# EAGLE board eps_version_0.4.0 (EAGLE 9.6.2), part 1 of 2
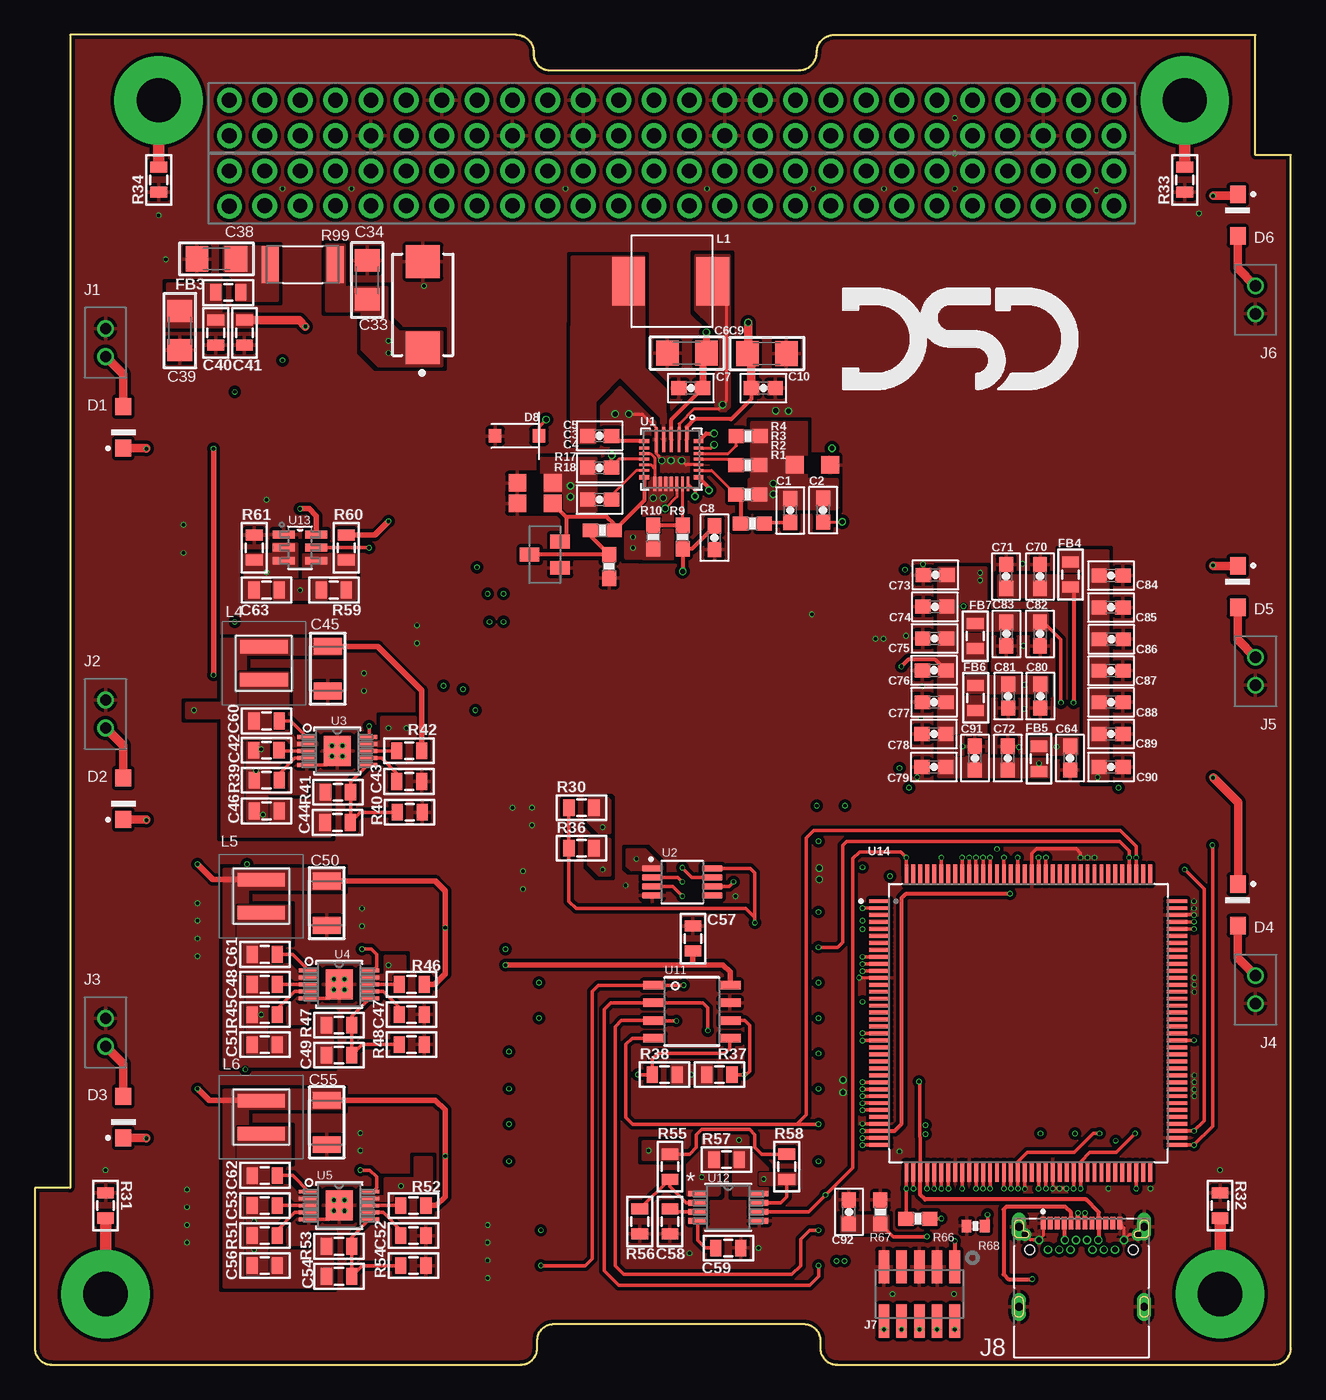
[diagram p9: board, top side]
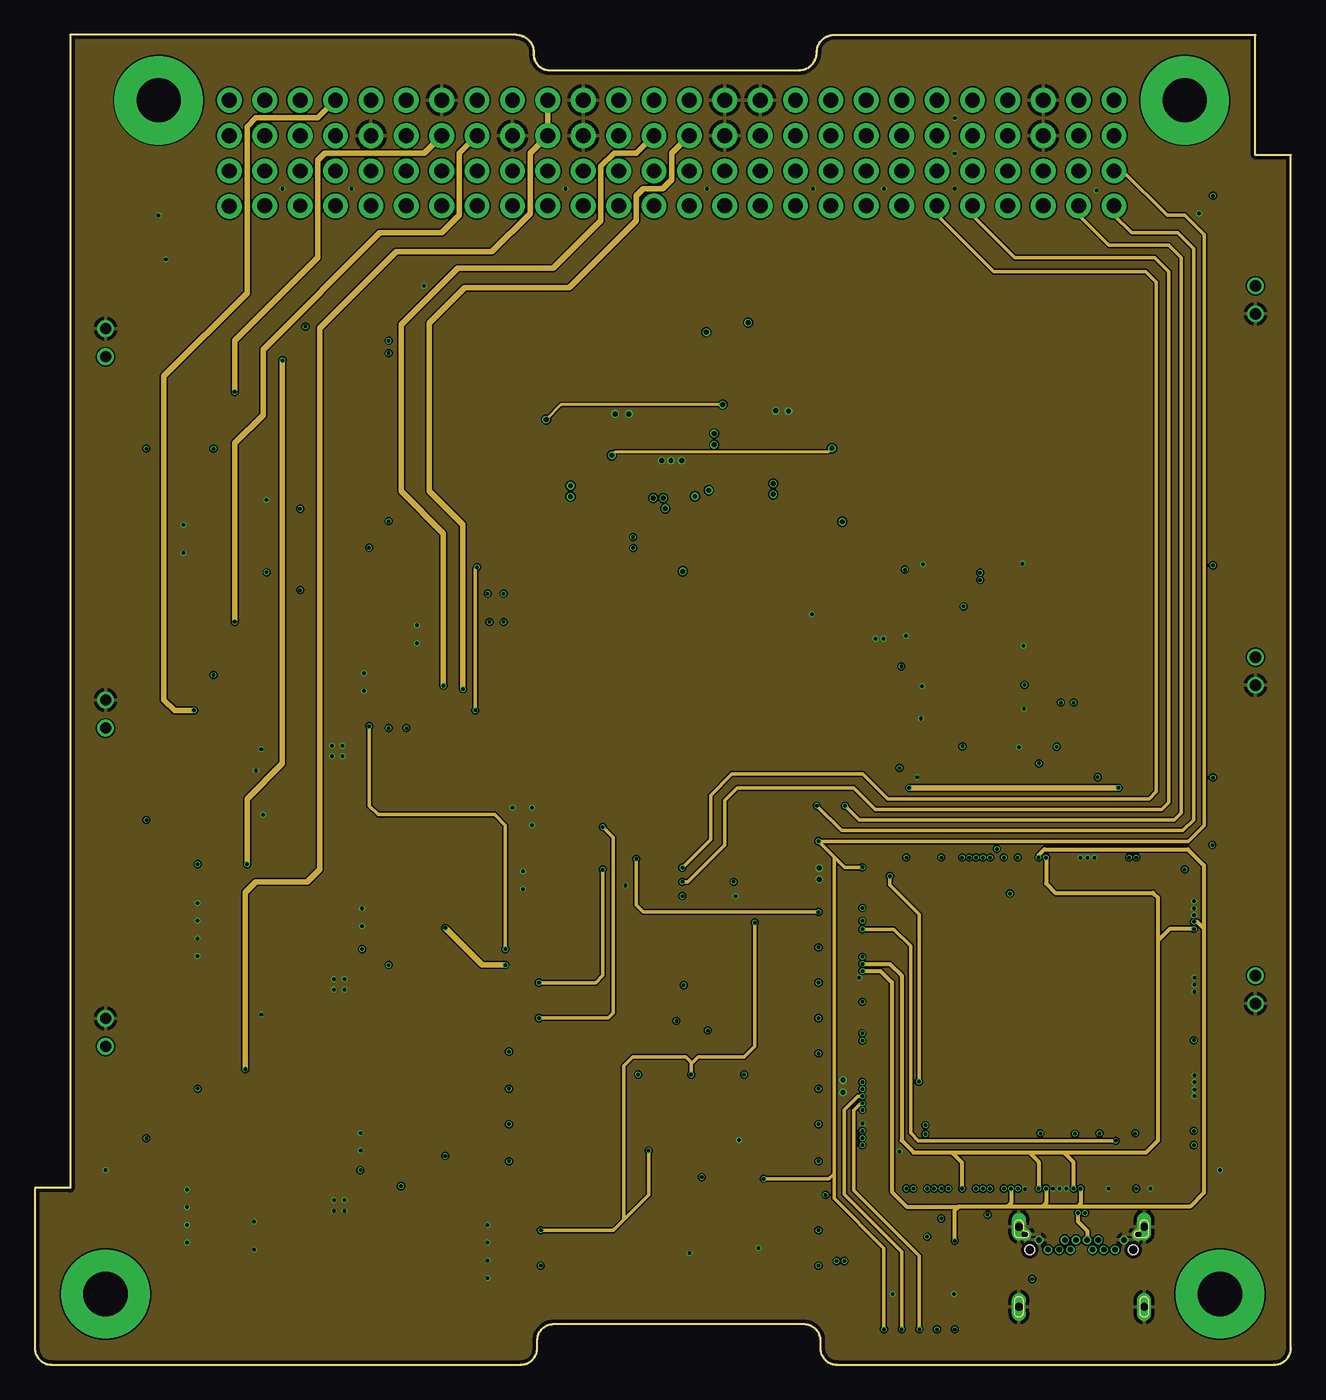
[diagram p10: board, inner layer Route2]
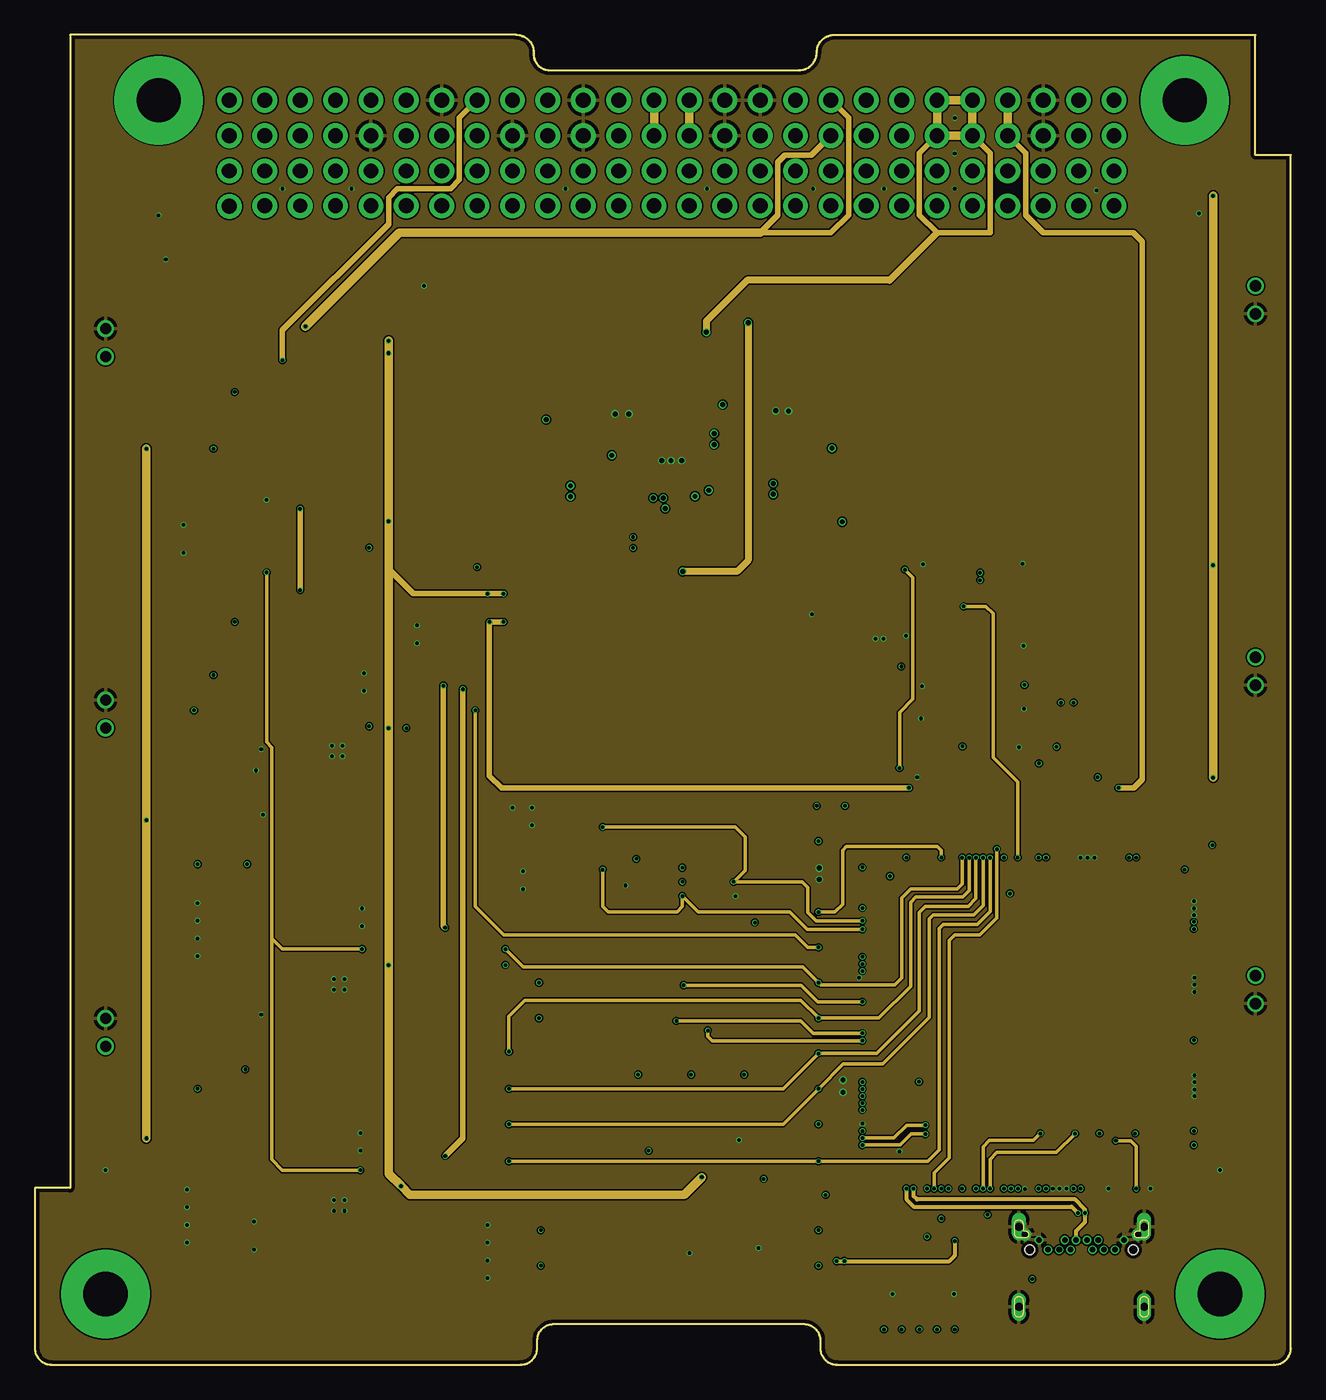
[diagram p11: board, inner layer Route15]
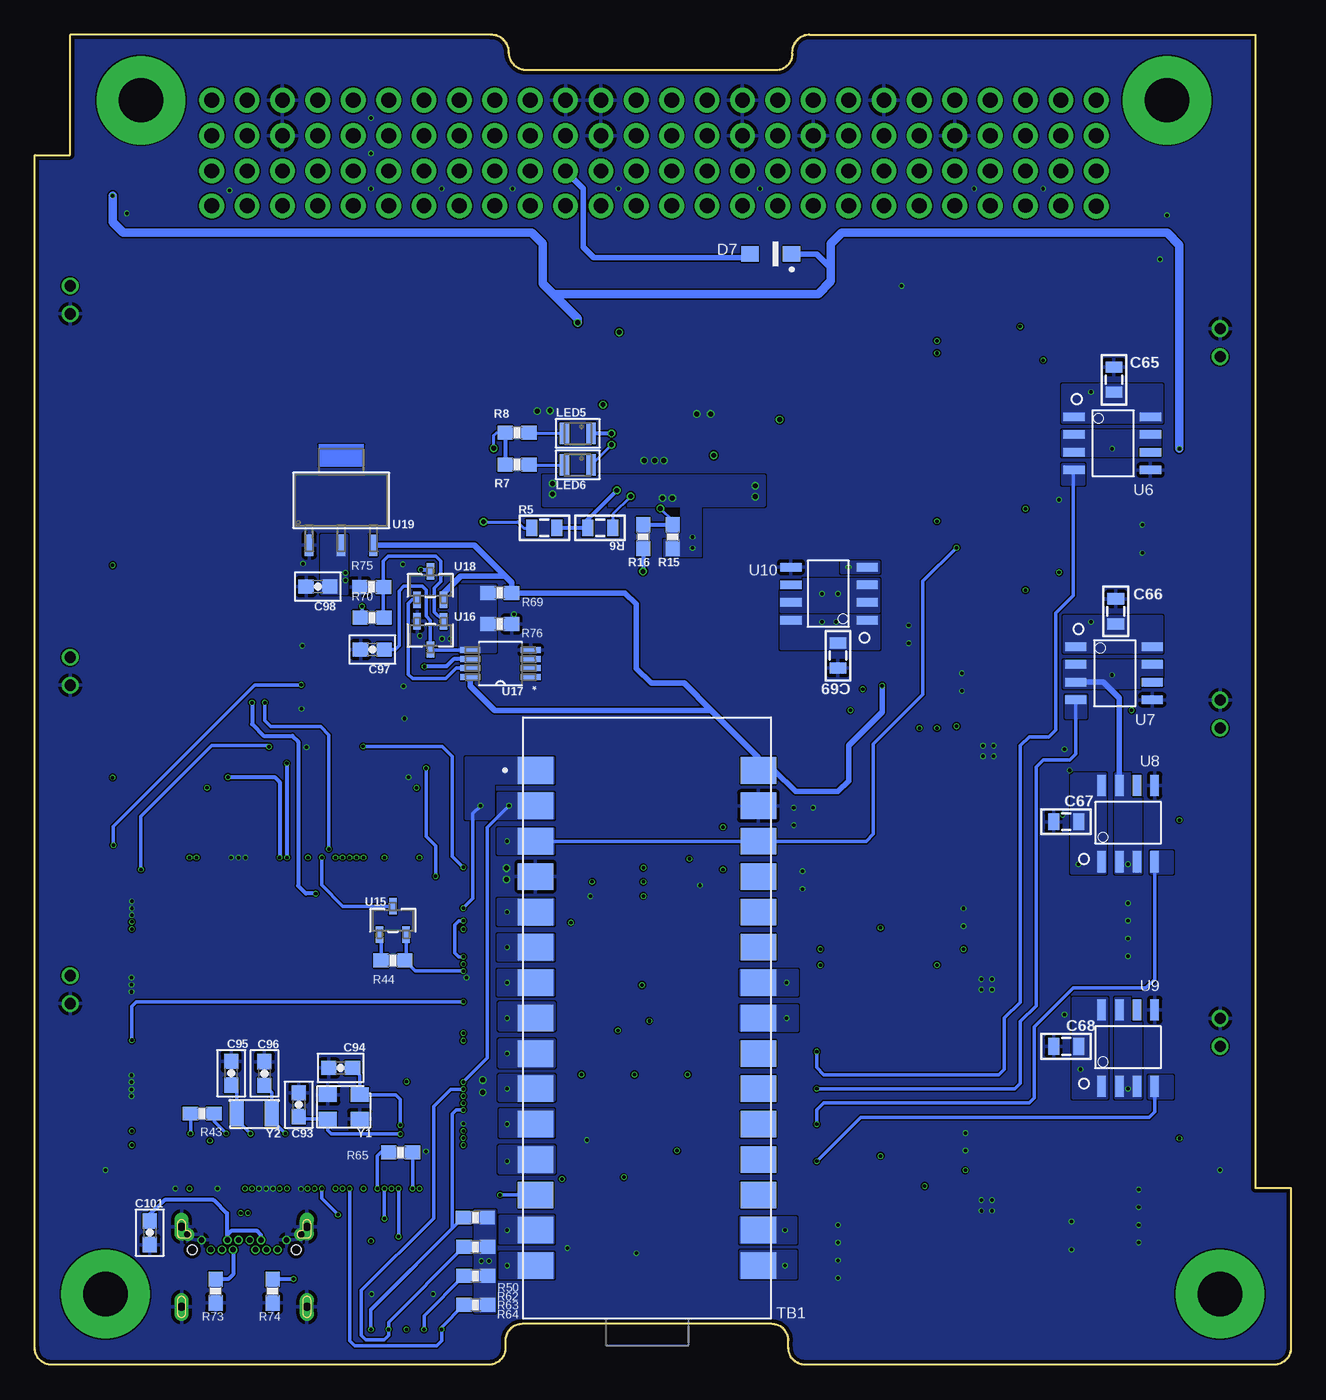
[diagram p12: board, bottom side, seen from below]

Size 90.17 x 95.5 mm. Coordinates in mm from the lower left corner, seen from the top.
Copper layers (1+2*15+16): Top 0.035mm / dielectric 1.5mm / Route2 0.035mm / dielectric 0.15mm / Route15 0.035mm / dielectric 0.2mm / Bottom 0.035mm
Design rules "AdvancedCircuitsExpensiveRestrictions *": minimum track width 4mil, minimum drill 4mil, track to track 4mil, track to pad 4mil, pad to pad 4mil, via to via 4mil, smd to smd 4mil, copper to edge 10mil, drill to drill 4mil, minimum pad ring 1mil, minimum via ring 1mil, stop-mask expansion 4mil, vias tented up to drill 0mil, thermal gap 10mil

## Footprints (pad centres in the part's own frame; a part is rotated, then mirrored left to right if it is on the bottom)
0603-CAP = smd 1.1 x 1: 1 -0.85,0; 2 0.85,0
1206 = smd 1.6 x 1.8: 1 -1.4,0; 2 1.4,0
CAPMP7343X430N = smd 2.35 x 2.45: 1 -3.1,0; 2 3.1,0
0805 = smd 0.8 x 1.2: 1 -0.9,0; 2 0.9,0
1210 = smd 1.2 x 2: 1 -1.6,0; 2 1.6,0
SODFL3616X98N = smd 1.24 x 1.12: A 1.49,0; C -1.49,0
SOD123 = smd 0.9 x 0.95: 1 0,0; 2 3.15,0
PC104_WCONN = drill 1.067 pad 1.778: 1.1 13.97,83.185; 1.2 13.97,85.725; 1.3 16.51,83.223; 1.4 16.51,85.725; 1.6 19.05,85.725; 1.7 21.59,83.223; 1.8 21.59,85.725; 1.9 24.13,83.223; 1.10 24.13,85.725; 1.11 26.67,83.223; 1.12 26.67,85.725; 1.13 29.21,83.223; 1.14 29.21,85.725; 1.15 31.75,83.223; 1.16 31.75,85.725; 1.17 34.29,83.223; 1.18 34.29,85.725; 1.19 36.83,83.223; 1.20 36.83,85.725; 1.21 39.37,83.223; 1.22 39.37,85.725; 1.23 41.91,83.223; 1.24 41.91,85.725; 1.25 44.45,83.223; 1.26 44.45,85.725; 1.27 46.99,83.223; 1.28 46.99,85.725; 1.29 49.53,83.223; 1.30 49.53,85.725; 1.31 52.07,83.223; 1.32 52.07,85.725; 1.33 54.61,83.223; 1.34 54.61,85.725; 1.35 57.15,83.223; 1.36 57.15,85.725; 1.37 59.69,83.223; 1.38 59.69,85.725; 1.39 62.23,83.223; 1.40 62.23,85.725; 1.41 64.77,83.223; 1.42 64.77,85.725; 1.43 67.31,83.223; 1.44 67.31,85.725; 1.45 69.85,83.223; 1.46 69.85,85.725; 1.47 72.39,83.223; 1.48 72.39,85.725; 1.49 74.93,83.223; 1.50 74.93,85.725; 1.51 77.47,83.223; 1.52 77.47,85.725; 2.1 13.97,88.265; 2.2 13.97,90.805; 2.3 16.51,88.265; 2.4 16.51,90.805; 2.5 19.05,88.265; 2.6 19.05,90.805; 2.7 21.59,88.265; 2.8 21.59,90.805; 2.9 24.13,88.265; 2.10 24.13,90.805; 2.11 26.67,88.265; 2.12 26.67,90.805; 2.13 29.21,88.265; 2.14 29.21,90.805; 2.15 31.75,88.265; 2.16 31.75,90.805; 2.17 34.29,88.265; 2.18 34.29,90.805; 2.19 36.83,88.265; 2.20 36.83,90.805; 2.21 39.37,88.265; 2.22 39.37,90.805; 2.23 41.91,88.265; 2.24 41.91,90.805; 2.25 44.45,88.265; 2.26 44.45,90.805; 2.27 46.99,88.265; 2.28 46.99,90.805; 2.29 49.53,88.265; 2.30 49.53,90.805; 2.31 52.07,88.265; 2.32 52.07,90.805; 2.33 54.61,88.265; 2.34 54.61,90.805; 2.35 57.15,88.265; 2.36 57.15,90.805; 2.37 59.69,88.265; 2.38 59.69,90.805; 2.39 62.23,88.265; 2.40 62.23,90.805; 2.41 64.77,88.265; 2.42 64.77,90.805; 2.43 67.31,88.265; 2.44 67.31,90.805; 2.45 69.85,88.265; 2.46 69.85,90.805; 2.47 72.39,88.265; 2.48 72.39,90.805; 2.49 74.93,88.265; 2.50 74.93,90.805; 2.51 77.47,88.265; 2.52 77.47,90.805 | drill 1.016 pad 1.778: 1.5 19.05,83.223 | drill 3.175 pad 6.35: P1 5.08,5.08; P2 85.09,5.08; P3 82.55,90.805; P4 8.89,90.805
2MM_2PIN_HEADER = drill 0.8: 1 0,0; 2 2.007,0
2X5_127 = smd 2.388 x 0.762: 1 -1.95,2.54; 2 1.95,2.54; 3 -1.95,1.27; 4 1.95,1.27; 5 -1.95,0; 6 1.95,0; 7 -1.95,-1.27; 8 1.95,-1.27; 9 -1.95,-2.54; 10 1.95,-2.54
CUI_UJ31-CH-G1-SMT-TR = smd 0.35 x 0.89: A1 0,0; A2 0.5,0; A3 1,0; A4 1.5,0; A5 2,0; A6 2.5,0; A7 3,0; A8 3.5,0; A9 4,0; A10 4.5,0; A11 5,0; A12 5.5,0 | drill 0.4 pad 0.6: B1 5.8,-1.205; B2 5.15,-1.905; B3 4.35,-1.905; B4 3.95,-1.205; B5 3.55,-1.905; B6 3.15,-1.205; B7 2.35,-1.205; B8 1.95,-1.905; B9 1.55,-1.205; B10 1.15,-1.905; B11 0.35,-1.905; B12 -0.3,-1.205 | drill 0.6 pad 1 long: SH1 -1.75,-6.005; SH3 -1.75,-0.255; SH4 7.25,-6.005; SH6 7.25,-0.255 | drill 0.5 pad 0.9: SH2 -1.3,-0.805; SH5 6.8,-0.805 | hole 0.7: -0.975,-1.905; 6.475,-1.905
FXL0630 = smd 2.35 x 3.5: 1 0,0; 2 6.05,0
XFL4030472MEB = smd 0.98 x 3.4: 1 -1.185,0; 2 1.185,0
LED_0805 = smd 0.711 x 1.524: 1 0,0; 2 1.905,0
SOT23 = smd 1 x 1.4: 1 0,0; 2 1.9,0; 3 0.95,2.2
GND-GNDA-1,27MM = smd 1.27 x 1.27: GND -1.27,0; GNDA 1.27,0
0603-RES = smd 1.1 x 1: 1 -0.85,0; 2 0.85,0
0402-RES = smd 0.7 x 0.9: 1 -0.65,0; 2 0.65,0
RESC5025X70N = smd 1.2 x 2.67: 1 -2.335,0; 2 2.335,0
SHIELD_ARDUINO_NANO = smd 2.54 x 1.905: P1 -8.001,17.78; P2 -8.001,15.24; P3 -8.001,12.7; P4 -8.001,10.16; P5 -8.001,7.62; P6 -8.001,5.08; P7 -8.001,2.54; P8 -8.001,0; P9 -8.001,-2.54; P10 -8.001,-5.08; P11 -8.001,-7.62; P12 -8.001,-10.16; P13 -8.001,-12.7; P14 -8.001,-15.24; P15 -8.001,-17.78; P16 8.001,-17.78; P17 8.001,-15.24; P18 8.001,-12.7; P19 8.001,-10.16; P20 8.001,-7.62; P21 8.001,-5.08; P22 8.001,-2.54; P23 8.001,0; P24 8.001,2.54; P25 8.001,5.08; P26 8.001,7.62; P27 8.001,10.16; P28 8.001,12.7; P29 8.001,15.24; P30 8.001,17.78
IC26_MP2639A_MNP = smd 1.803 x 0.203: 1 -1.4,1.1; 2 -1.4,0.55; 3 -1.4,0; 4 -1.4,-0.55; 5 -1.4,-1.1 | smd 0.305 x 0.711: 6 -1.3,-1.95; 12 1.3,-1.95; 20 1.3,1.95; 26 -1.3,1.95 | smd 0.203 x 0.711: 7 -0.8,-1.95; 8 -0.4,-1.95; 9 0,-1.95; 10 0.4,-1.95; 11 0.8,-1.95; 21 0.8,1.95; 22 0.4,1.95; 23 0,1.95; 24 -0.4,1.95; 25 -0.8,1.95 | smd 1.041 x 0.203: 13 1.775,-1.2; 14 1.775,-0.8; 15 1.775,-0.4; 16 1.775,0; 17 1.775,0.4; 18 1.775,0.8; 19 1.775,1.2
SOP65P490X110-8N = smd 1.47 x 0.48: 1 -2.15,0.975; 2 -2.15,0.325; 3 -2.15,-0.325; 4 -2.15,-0.975; 5 2.15,-0.975; 6 2.15,-0.325; 7 2.15,0.325; 8 2.15,0.975
MSOP-10_MSE = smd 1.397 x 0.279: 1 -2.184,1.001; 2 -2.184,0.5; 3 -2.184,0; 4 -2.184,-0.5; 5 -2.184,-1.001; 6 2.184,-1.001; 7 2.184,-0.5; 8 2.184,0; 9 2.184,0.5; 10 2.184,1.001 | smd 1.93 x 2.159: 11 0,0
SO8 = smd 1.524 x 0.61: 1 -2.743,1.27; 2 -2.743,0; 3 -2.743,-1.27; 4 -2.743,-2.54; 5 2.743,-2.54; 6 2.743,-1.27; 7 2.743,0; 8 2.743,1.27
SOIC-8 = smd 1.524 x 0.61: 1 -2.68,1.855; 2 -2.68,0.585; 3 -2.68,-0.685; 4 -2.68,-1.955; 5 2.78,-1.955; 6 2.78,-0.685; 7 2.78,0.585; 8 2.78,1.855
21-0036K_MXM = smd 1.321 x 0.406: 1 -2.21,0.975; 2 -2.21,0.325; 3 -2.21,-0.325; 4 -2.21,-0.975; 5 2.21,-0.975; 6 2.21,-0.325; 7 2.21,0.325; 8 2.21,0.975
DDC0006A_N = smd 1.575 x 0.559: 1 -1.168,0.95; 2 -1.168,0; 3 -1.168,-0.95; 4 1.168,-0.95; 5 1.168,0; 6 1.168,0.95
LQFP144 = smd 1.47 x 0.28: 1 -10.67,8.75; 2 -10.67,8.25; 3 -10.67,7.75; 4 -10.67,7.25; 5 -10.67,6.75; 6 -10.67,6.25; 7 -10.67,5.75; 8 -10.67,5.25; 9 -10.67,4.75; 10 -10.67,4.25; 11 -10.67,3.75; 12 -10.67,3.25; 13 -10.67,2.75; 14 -10.67,2.25; 15 -10.67,1.75; 16 -10.67,1.25; 17 -10.67,0.75; 18 -10.67,0.25; 19 -10.67,-0.25; 20 -10.67,-0.75; 21 -10.67,-1.25; 22 -10.67,-1.75; 23 -10.67,-2.25; 24 -10.67,-2.75; 25 -10.67,-3.25; 26 -10.67,-3.75; 27 -10.67,-4.25; 28 -10.67,-4.75; 29 -10.67,-5.25; 30 -10.67,-5.75; 31 -10.67,-6.25; 32 -10.67,-6.75; 33 -10.67,-7.25; 34 -10.67,-7.75; 35 -10.67,-8.25; 36 -10.67,-8.75; 73 10.67,-8.75; 74 10.67,-8.25; 75 10.67,-7.75; 76 10.67,-7.25; 77 10.67,-6.75; 78 10.67,-6.25; 79 10.67,-5.75; 80 10.67,-5.25; 81 10.67,-4.75; 82 10.67,-4.25; 83 10.67,-3.75; 84 10.67,-3.25; 85 10.67,-2.75; 86 10.67,-2.25; 87 10.67,-1.75; 88 10.67,-1.25; 89 10.67,-0.75; 90 10.67,-0.25; 91 10.67,0.25; 92 10.67,0.75; 93 10.67,1.25; 94 10.67,1.75; 95 10.67,2.25; 96 10.67,2.75; 97 10.67,3.25; 98 10.67,3.75; 99 10.67,4.25; 100 10.67,4.75; 101 10.67,5.25; 102 10.67,5.75; 103 10.67,6.25; 104 10.67,6.75; 105 10.67,7.25; 106 10.67,7.75; 107 10.67,8.25; 108 10.67,8.75 | smd 0.28 x 1.47: 37 -8.75,-10.67; 38 -8.25,-10.67; 39 -7.75,-10.67; 40 -7.25,-10.67; 41 -6.75,-10.67; 42 -6.25,-10.67; 43 -5.75,-10.67; 44 -5.25,-10.67; 45 -4.75,-10.67; 46 -4.25,-10.67; 47 -3.75,-10.67; 48 -3.25,-10.67; 49 -2.75,-10.67; 50 -2.25,-10.67; 51 -1.75,-10.67; 52 -1.25,-10.67; 53 -0.75,-10.67; 54 -0.25,-10.67; 55 0.25,-10.67; 56 0.75,-10.67; 57 1.25,-10.67; 58 1.75,-10.67; 59 2.25,-10.67; 60 2.75,-10.67; 61 3.25,-10.67; 62 3.75,-10.67; 63 4.25,-10.67; 64 4.75,-10.67; 65 5.25,-10.67; 66 5.75,-10.67; 67 6.25,-10.67; 68 6.75,-10.67; 69 7.25,-10.67; 70 7.75,-10.67; 71 8.25,-10.67; 72 8.75,-10.67; 109 8.75,10.67; 110 8.25,10.67; 111 7.75,10.67; 112 7.25,10.67; 113 6.75,10.67; 114 6.25,10.67; 115 5.75,10.67; 116 5.25,10.67; 117 4.75,10.67; 118 4.25,10.67; 119 3.75,10.67; 120 3.25,10.67; 121 2.75,10.67; 122 2.25,10.67; 123 1.75,10.67; 124 1.25,10.67; 125 0.75,10.67; 126 0.25,10.67; 127 -0.25,10.67; 128 -0.75,10.67; 129 -1.25,10.67; 130 -1.75,10.67; 131 -2.25,10.67; 132 -2.75,10.67; 133 -3.25,10.67; 134 -3.75,10.67; 135 -4.25,10.67; 136 -4.75,10.67; 137 -5.25,10.67; 138 -5.75,10.67; 139 -6.25,10.67; 140 -6.75,10.67; 141 -7.25,10.67; 142 -7.75,10.67; 143 -8.25,10.67; 144 -8.75,10.67
TO-236_SOT23_NEX = smd 0.533 x 1.168: 1 -0.95,-1.016; 2 0.95,-1.016; 3 0,1.016
DGK8 = smd 1.422 x 0.432: 1 -2.172,0.975; 2 -2.172,0.325; 3 -2.172,-0.325; 4 -2.172,-0.975; 5 2.172,-0.975; 6 2.172,-0.325; 7 2.172,0.325; 8 2.172,0.975
SOT223-3_ONS = smd 0.61 x 1.549: 1 -2.299,-3.226; 2 0,-3.226; 3 2.299,-3.226
ABM8 = smd 1.3 x 1.05: 1 0.65,0.525; 2 2.95,0.525; 3 2.95,2.275; 4 0.65,2.275
FC-135 = smd 1 x 1.8: 1 0.5,0.9; 2 3,0.9

## Placement (x,y rotation side)
C1  33pF  [0603-CAP]  54.23,61.34 270 top
C2  0  [0603-CAP]  56.59,61.37 270 top
C3  1uF  [0603-CAP]  40.54,64.41 180 top
C4  0.1uF  [0603-CAP]  40.54,62.13 180 top
C5  0.1uF  [0603-CAP]  40.54,66.7 0 top
C6  10uF  [1206]  46.81,72.64 180 top
C7  1uF  [0603-CAP]  47.09,70.13 180 top
C8  4.7uF  [0603-CAP]  48.79,59.39 90 top
C9  10uF  [1206]  52.55,72.62 180 top
C10  4.7uF  [0603-CAP]  52.3,70.13 180 top
C33  22uF  [CAPMP7343X430N]  27.86,76.12 90 top
C34  4.7uF  [1206]  23.86,77.9 90 top
C38  4.7uF  [1206]  13.04,79.41 180 top
C39  4.7uF  [1206]  10.41,74.26 270 top
C40  0.1uF  [0805]  12.99,74.11 270 top
C41  1uF  [0805]  15.05,74.11 270 top
C42  1uF  [0805]  16.63,44.12 180 top
C43  0.1uF  [0805]  26.88,41.88 0 top
C44  10pF  [0805]  21.73,38.94 180 top
C45  47uF  [1210]  21.03,49.98 270 top
C46  4.7uF  [0805]  16.64,39.77 180 top
C47  0.1uF  [0805]  27.05,25.15 0 top
C48  1uF  [0805]  16.51,27.3 180 top
C49  10pF  [0805]  21.84,22.23 180 top
C50  47uF  [1210]  20.95,33.15 270 top
C51  4.7uF  [0805]  16.51,22.99 180 top
C52  0.1uF  [0805]  27.18,9.27 0 top
C53  1uF  [0805]  16.51,11.43 180 top
C54  10pF  [0805]  21.84,6.35 180 top
C55  47uF  [1210]  20.95,17.4 270 top
C56  4.7uF  [0805]  16.51,7.11 180 top
C57  0.1uF  [0805]  47.24,30.61 90 top
C58  0.1uF  [0805]  45.59,10.29 270 top
C59  1uF  [0805]  49.78,8.38 0 top
C60  C61  [0805]  16.64,46.23 180 top
C61  0.1uF  [0805]  16.51,29.46 180 top
C62  0.1uF  [0805]  16.51,13.59 180 top
C63  10nF  [0805]  16.64,55.63 0 top
C64  100nF  [0603-CAP]  74.32,43.56 270 top
C65  1uF  [0805]  12.7,70.74 90 bottom
C66  1uF  [0805]  12.57,54.1 90 bottom
C67  1uF  [0805]  16.13,38.99 180 bottom
C68  1uF  [0805]  16.13,22.86 180 bottom
C69  1uF  [0805]  32.51,50.93 270 bottom
C70  22uF  [0603-CAP]  72.16,56.62 90 top
C71  100nF  [0603-CAP]  69.72,56.62 90 top
C72  100nF  [0603-CAP]  69.85,43.56 90 top
C73  22uF  [0603-CAP]  64.64,56.72 180 top
C74  100nF  [0603-CAP]  64.62,54.43 180 top
C75  100nF  [0603-CAP]  64.59,52.15 180 top
C76  100nF  [0603-CAP]  64.57,49.86 180 top
C77  100nF  [0603-CAP]  64.57,47.57 180 top
C78  100nF  [0603-CAP]  64.54,45.29 180 top
C79  100nF  [0603-CAP]  64.54,42.93 180 top
C80  22uF  [0603-CAP]  72.19,48.01 270 top
C81  100nF  [0603-CAP]  69.88,48.01 270 top
C82  22uF  [0603-CAP]  72.16,52.48 270 top
C83  100nF  [0603-CAP]  69.75,52.48 270 top
C84  22uF  [0603-CAP]  77.27,56.67 0 top
C85  100nF  [0603-CAP]  77.27,54.38 0 top
C86  100nF  [0603-CAP]  77.29,52.1 0 top
C87  100nF  [0603-CAP]  77.27,49.83 0 top
C88  100nF  [0603-CAP]  77.27,47.57 0 top
C89  100nF  [0603-CAP]  77.27,45.29 0 top
C90  100nF  [0603-CAP]  77.27,42.93 0 top
C91  10nF  [0603-CAP]  67.49,43.56 90 top
C92  22pF  [0603-CAP]  58.45,10.97 90 top
C93  22pF  [0603-CAP]  71.22,18.67 270 bottom
C94  22pF  [0603-CAP]  68.22,21.31 180 bottom
C95  22pF  [0603-CAP]  76.07,20.93 90 bottom
C96  22pF  [0603-CAP]  73.69,20.9 270 bottom
C97  100nF  [0603-CAP]  65.94,51.36 180 bottom
C98  22uF  [0603-CAP]  69.85,55.88 180 bottom
C101  4.7uF  [0603-CAP]  81.92,9.47 270 bottom
D1  DNP  [SODFL3616X98N]  6.35,67.31 90 top
D2  DNP  [SODFL3616X98N]  6.35,40.64 90 top
D3  DNP  [SODFL3616X98N]  6.35,17.78 90 top
D4  DNP  [SODFL3616X98N]  86.36,33.02 270 top
D5  DNP  [SODFL3616X98N]  86.36,55.88 270 top
D6  DNP  [SODFL3616X98N]  86.36,82.55 270 top
D7  DNP  [SODFL3616X98N]  37.34,79.76 180 bottom
D8  1N5819HW  [SOD123]  36.2,66.7 180 top
FB3  330  [0805]  13.89,77 0 top
FB4  MH2029-300Y  [0805]  74.35,56.74 270 top
FB5  MH2029-300Y  [0805]  72.09,43.51 90 top
FB6  FB0805  [0805]  67.54,47.88 90 top
FB7  FB0805  [0805]  67.51,52.32 90 top
H1  PC104_WCONN  [PC104_WCONN]  0,0 0 top
J1  2PIN_HEADER  [2MM_2PIN_HEADER]  5.08,72.39 90 top
J2  2PIN_HEADER  [2MM_2PIN_HEADER]  5.08,45.72 90 top
J3  2PIN_HEADER  [2MM_2PIN_HEADER]  5.08,22.86 90 top
J4  2PIN_HEADER  [2MM_2PIN_HEADER]  87.63,27.94 270 top
J5  2PIN_HEADER  [2MM_2PIN_HEADER]  87.63,50.8 270 top
J6  2PIN_HEADER  [2MM_2PIN_HEADER]  87.63,77.47 270 top
J7  CONN_2X5_127  [2X5_127]  63.5,5.08 270 top
J8  USB-C  [CUI_UJ31-CH-G1-SMT-TR]  72.39,10.16 0 top
L1  IND-FXL0630  [FXL0630]  48.67,77.8 180 top
L4  2.2uH  [XFL4030472MEB]  16.44,50.36 90 top
L5  2.2uH  [XFL4030472MEB]  16.26,33.66 90 top
L6  2.2uH  [XFL4030472MEB]  16.26,17.78 90 top
LED5  LED_0805  [LED_0805]  52.15,66.88 0 bottom
LED6  LED_0805  [LED_0805]  52.15,64.62 0 bottom
M1  A03400  [SOT23]  37.72,57.23 90 top
NT1  GND-GNDA1,27MM  [GND-GNDA-1,27MM]  35.92,61.85 0 top
NT2  GND-GNDA1,27MM  [GND-GNDA-1,27MM]  55.83,64.62 180 top
NT3  GND-GNDA1,27MM  [GND-GNDA-1,27MM]  35.92,63.32 0 top
R1  10K  [0603-RES]  51.51,60.4 0 top
R2  40.2K  [0603-RES]  51.18,62.48 0 top
R3  86.6K  [0603-RES]  51.18,64.59 0 top
R4  71.5K  [0603-RES]  51.21,66.67 0 top
R5  15K  [0805]  53.59,60.1 180 bottom
R6  10K  [0805]  49.58,60.1 180 bottom
R7  2K  [0603-RES]  55.55,64.64 180 bottom
R8  2K  [0603-RES]  55.55,66.93 180 bottom
R9  27.4K  [0603-RES]  46.51,59.44 90 top
R10  10K  [0603-RES]  44.4,59.44 270 top
R15  0  [0603-RES]  44.37,59.46 270 bottom
R16  DNP  [0603-RES]  46.51,59.46 270 bottom
R17  100  [0603-RES]  40.74,59.92 180 top
R18  1K  [0603-RES]  41.22,57.33 90 top
R30  2K  [0805]  39.24,40.01 180 top
R31  1M  [0805]  5.08,11.43 270 top
R32  1M  [0805]  85.09,11.43 270 top
R33  1M  [0805]  82.55,85.09 90 top
R34  1M  [0805]  8.89,85.09 90 top
R36  2K  [0805]  39.24,37.08 180 top
R37  10K  [0805]  49.15,20.83 180 top
R38  10K  [0805]  45.21,20.83 0 top
R39  18.2K  [0805]  16.64,41.97 0 top
R40  182K  [0805]  26.91,39.67 180 top
R41  1.0M  [0805]  21.76,41.11 180 top
R42  49.9K  [0805]  26.88,44.08 0 top
R43  100K  [0603-RES]  78.16,18.03 180 bottom
R44  10K  [0603-RES]  64.47,29.03 0 bottom
R45  18.2K  [0805]  16.51,25.15 0 top
R46  49.9K  [0805]  27.05,27.3 0 top
R47  1.0M  [0805]  21.84,24.38 180 top
R48  182K  [0805]  27.05,22.99 180 top
R50  100K  [0603-RES]  58.55,10.57 0 bottom
R51  18.2K  [0805]  16.51,9.27 0 top
R52  49.9K  [0805]  27.18,11.43 0 top
R53  1.0M  [0805]  21.84,8.51 180 top
R54  300K  [0805]  27.18,7.11 180 top
R55  62K  [0805]  45.59,14.22 90 top
R56  100K  [0805]  43.43,10.29 90 top
R57  10K  [0805]  49.66,14.73 180 top
R58  2K  [0805]  53.98,14.22 90 top
R59  127K  [0805]  21.46,55.63 0 top
R60  1M  [0805]  22.35,58.67 270 top
R61  191K  [0805]  15.75,58.67 270 top
R62  100K  [0603-RES]  58.52,8.46 0 bottom
R63  100K  [0603-RES]  58.52,6.38 0 bottom
R64  100K  [0603-RES]  58.52,4.29 0 bottom
R65  39R 1%  [0603-RES]  63.91,15.24 180 bottom
R66  39R 1%  [0603-RES]  63.4,10.49 0 top
R67  6.8K  [0603-RES]  60.71,10.97 270 top
R68  0  [0402-RES]  67.54,9.96 0 top
R69  100K  [0603-RES]  56.79,55.42 0 bottom
R70  1K  [0603-RES]  65.96,53.64 0 bottom
R73  5.1K  [0603-RES]  77.19,5.28 90 bottom
R74  5.1K  [0603-RES]  73.1,5.28 90 bottom
R75  100K  [0603-RES]  65.99,55.85 0 bottom
R76  100K  [0603-RES]  56.79,53.19 180 bottom
R99  0  [RESC5025X70N]  19.23,79.01 0 top
TB1  ARDUINO_NANO  [SHIELD_ARDUINO_NANO]  46.23,24.89 0 bottom
U1  MP2639A  [IC26_MP2639A_MNP]  45.69,65.02 270 top
U2  TCA9511A  [SOP65P490X110-8N]  46.48,34.67 0 top
U3  LT8609A  [MSOP-10_MSE]  21.72,44.07 0 top
U4  LT8609A  [MSOP-10_MSE]  21.84,27.3 0 top
U5  LT8609A  [MSOP-10_MSE]  21.84,11.43 0 top
U6  LTC1477  [SO8]  12.83,66.8 0 bottom
U7  LTC1477  [SO8]  12.7,50.29 0 bottom
U8  LTC1477  [SO8]  12.32,38.86 90 bottom
U9  LTC1477  [SO8]  12.32,22.73 90 bottom
U10  LTC1477  [SO8]  33.15,54.74 180 bottom
U11  ADT7311  [SOIC-8]  47.12,25.4 0 top
U12  MAX16998AAUA+  [21-0036K_MXM]  49.78,11.3 0 top
U13  Value  [DDC0006A_N]  19.05,58.67 0 top
U14  ATSAM3X8EA-AU  [LQFP144]  71.32,24.54 0 top
U15  PMV48XP  [TO-236_SOT23_NEX]  64.47,31.9 0 bottom
U16  BC847B-7-F  [TO-236_SOT23_NEX]  61.77,52.37 180 bottom
U17  LMV358IDGKR  [DGK8]  56.74,50.34 180 bottom
U18  PMV48XP,215  [TO-236_SOT23_NEX]  61.77,55.96 0 bottom
U19  NCP1117ST33T3G  [SOT223-3_ONS]  68.17,62.08 0 bottom
Y1  ABM8  [ABM8]  66.19,19.91 180 bottom
Y2  FC-135R  [FC-135]  76.17,17.12 0 bottom